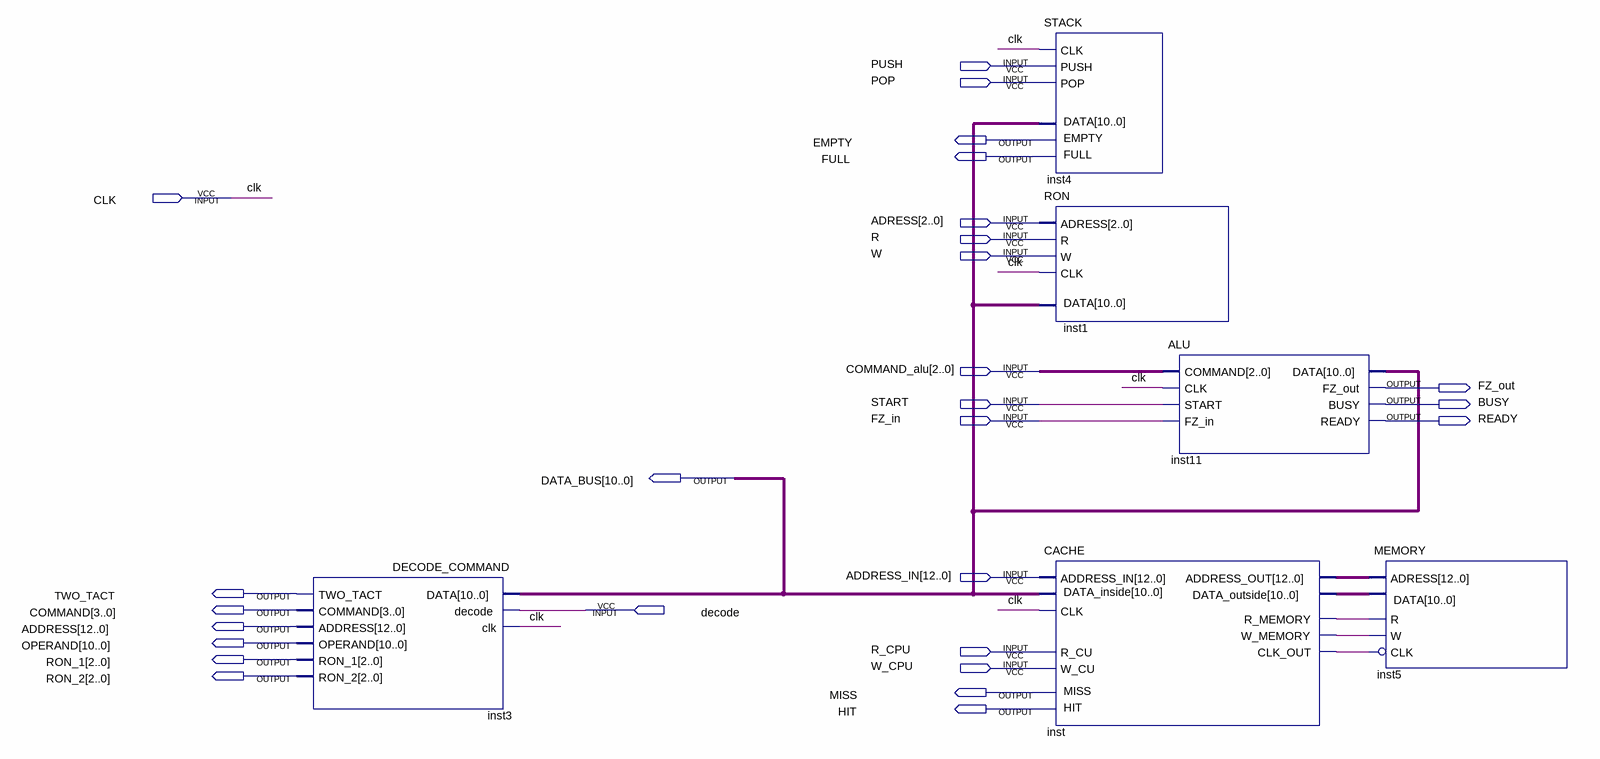
[diagram p0: schematic sheet]
// Quartus schematic Test_CU.bdf as structural Verilog: 6 symbols, 27 pins
module Test_CU (
  input  PUSH,
  input  POP,
  input  CLK,
  input  [2:0] ADRESS,
  input  R,
  input  W,
  input  [2:0] COMMAND_alu,
  input  START,
  input  FZ_in,
  input  [12:0] ADDRESS_IN,
  input  decode,
  input  R_CPU,
  input  W_CPU,
  output EMPTY,
  output FULL,
  output FZ_out,
  output BUSY,
  output READY,
  output [10:0] DATA_BUS,
  output TWO_TACT,
  output [3:0] COMMAND,
  output [12:0] ADDRESS,
  output [10:0] OPERAND,
  output [2:0] RON_1,
  output [2:0] RON_2,
  output MISS,
  output HIT
);

  wire inst_clk_out, inst_r_memory, inst_w_memory;
  wire [10:0] inst_data_outside;
  wire [12:0] inst_address_out;

  DECODE_COMMAND inst3 (
    .DATA(DATA_BUS), .decode(decode), .clk(CLK), .TWO_TACT(TWO_TACT), .COMMAND(COMMAND), .ADDRESS(ADDRESS),
    .OPERAND(OPERAND), .RON_1(RON_1), .RON_2(RON_2));
  STACK inst4 (.CLK(CLK), .PUSH(PUSH), .POP(POP), .EMPTY(EMPTY), .FULL(FULL), .DATA(DATA_BUS));
  RON inst1 (.ADRESS(ADRESS), .R(R), .W(W), .CLK(CLK), .DATA(DATA_BUS));
  CACHE inst (
    .CLK(CLK), .ADDRESS_IN(ADDRESS_IN), .R_CU(R_CPU), .W_CU(W_CPU), .R_MEMORY(inst_r_memory),
    .W_MEMORY(inst_w_memory), .CLK_OUT(inst_clk_out), .ADDRESS_OUT(inst_address_out), .HIT(HIT), .MISS(MISS),
    .DATA_outside(inst_data_outside), .DATA_inside(DATA_BUS));
  ALU inst11 (
    .COMMAND(COMMAND_alu), .CLK(CLK), .START(START), .FZ_in(FZ_in), .FZ_out(FZ_out), .BUSY(BUSY),
    .READY(READY), .DATA(DATA_BUS));
  MEMORY inst5 (
    .ADRESS(inst_address_out), .R(inst_r_memory), .W(inst_w_memory), .CLK(~inst_clk_out),
    .DATA(inst_data_outside));
endmodule
